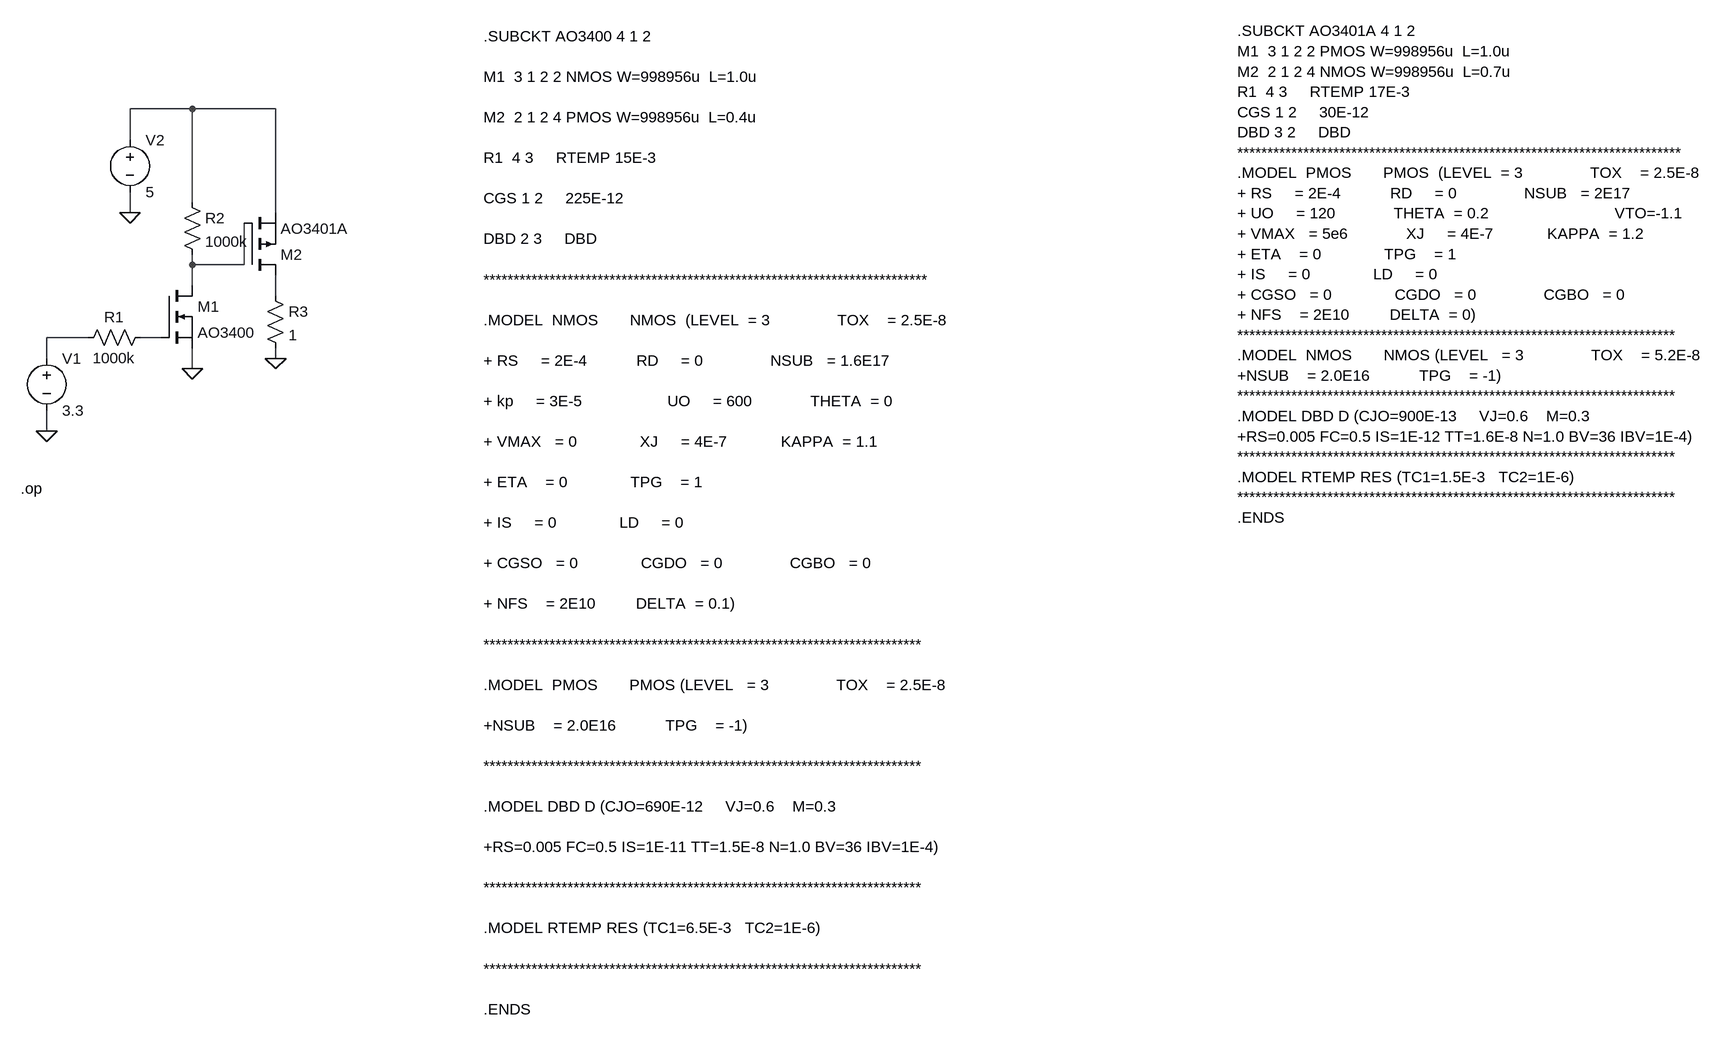
[diagram p0: schematic LoadSwitchSimulation.asc]
LoadSwitchSimulation.asc, the LTspice schematic file:
Version 4.1
SHEET 1 3032 680
WIRE 336 -224 240 -224
WIRE 464 -224 336 -224
WIRE 240 -176 240 -224
WIRE 336 -80 336 -224
WIRE 240 -64 240 -96
WIRE 464 -64 464 -224
WIRE 336 16 336 0
WIRE 416 16 416 -48
WIRE 416 16 336 16
WIRE 336 48 336 16
WIRE 464 64 464 32
WIRE 176 128 112 128
WIRE 288 128 256 128
WIRE 112 160 112 128
WIRE 464 160 464 144
WIRE 336 176 336 144
WIRE 112 272 112 240
FLAG 112 272 0
FLAG 336 176 0
FLAG 240 -64 0
FLAG 464 160 0
SYMBOL voltage 112 144 R0
WINDOW 123 0 0 Left 0
WINDOW 39 0 0 Left 0
SYMATTR InstName V1
SYMATTR Value 3.3
SYMBOL res 272 112 R90
WINDOW 0 0 56 VBottom 2
WINDOW 3 32 56 VTop 2
SYMATTR InstName R1
SYMATTR Value 1000k
SYMBOL nmos 288 48 R0
SYMATTR InstName M1
SYMATTR Value AO3400
SYMATTR Prefix X
SYMBOL pmos 416 32 M180
SYMATTR InstName M2
SYMATTR Value AO3401A
SYMATTR Prefix X
SYMBOL res 320 -96 R0
SYMATTR InstName R2
SYMATTR Value 1000k
SYMBOL voltage 240 -192 R0
WINDOW 123 0 0 Left 0
WINDOW 39 0 0 Left 0
SYMATTR InstName V2
SYMATTR Value 5
SYMBOL res 448 48 R0
SYMATTR InstName R3
SYMATTR Value 1
TEXT 784 -336 Left 2 !.SUBCKT AO3400 4 1 2\n\nM1  3 1 2 2 NMOS W=998956u  L=1.0u \n\nM2  2 1 2 4 PMOS W=998956u  L=0.4u\n\nR1  4 3     RTEMP 15E-3\n\nCGS 1 2     225E-12\n\nDBD 2 3     DBD\n\n**************************************************************************\n\n.MODEL  NMOS       NMOS  (LEVEL  = 3               TOX    = 2.5E-8\n\n+ RS     = 2E-4           RD     = 0               NSUB   = 1.6E17  \n\n+ kp     = 3E-5                   UO     = 600             THETA  = 0\n\n+ VMAX   = 0              XJ     = 4E-7            KAPPA  = 1.1\n\n+ ETA    = 0              TPG    = 1  \n\n+ IS     = 0              LD     = 0                           \n\n+ CGSO   = 0              CGDO   = 0               CGBO   = 0 \n\n+ NFS    = 2E10         DELTA  = 0.1)\n\n*************************************************************************\n\n.MODEL  PMOS       PMOS (LEVEL   = 3               TOX    = 2.5E-8\n\n+NSUB    = 2.0E16           TPG    = -1)   \n\n*************************************************************************\n\n.MODEL DBD D (CJO=690E-12     VJ=0.6    M=0.3\n\n+RS=0.005 FC=0.5 IS=1E-11 TT=1.5E-8 N=1.0 BV=36 IBV=1E-4)\n\n*************************************************************************\n\n.MODEL RTEMP RES (TC1=6.5E-3   TC2=1E-6)\n\n*************************************************************************\n\n.ENDS
TEXT 1944 -344 Left 2 !.SUBCKT AO3401A 4 1 2\nM1  3 1 2 2 PMOS W=998956u  L=1.0u \nM2  2 1 2 4 NMOS W=998956u  L=0.7u\nR1  4 3     RTEMP 17E-3\nCGS 1 2     30E-12\nDBD 3 2     DBD\n**************************************************************************\n.MODEL  PMOS       PMOS  (LEVEL  = 3               TOX    = 2.5E-8\n+ RS     = 2E-4           RD     = 0               NSUB   = 2E17  \n+ UO     = 120             THETA  = 0.2                            VTO=-1.1\n+ VMAX   = 5e6             XJ     = 4E-7            KAPPA  = 1.2\n+ ETA    = 0              TPG    = 1  \n+ IS     = 0              LD     = 0                           \n+ CGSO   = 0              CGDO   = 0               CGBO   = 0 \n+ NFS    = 2E10         DELTA  = 0)\n*************************************************************************\n.MODEL  NMOS       NMOS (LEVEL   = 3               TOX    = 5.2E-8\n+NSUB    = 2.0E16           TPG    = -1)   \n*************************************************************************\n.MODEL DBD D (CJO=900E-13     VJ=0.6    M=0.3\n+RS=0.005 FC=0.5 IS=1E-12 TT=1.6E-8 N=1.0 BV=36 IBV=1E-4)\n*************************************************************************\n.MODEL RTEMP RES (TC1=1.5E-3   TC2=1E-6)\n*************************************************************************\n.ENDS
TEXT 72 360 Left 2 !.op

The netlist it stands for:
* LoadSwitchSimulation.asc
V1 N004 0 3.3
R1 N005 N004 1000k
X§M1 N002 N005 0 AO3400  ; pins D G S
X§M2 N003 N002 N001 AO3401A  ; pins D G S
R2 N001 N002 1000k
V2 N001 0 5
R3 N003 0 1
.SUBCKT AO3400 4 1 2
M1  3 1 2 2 NMOS W=998956u  L=1.0u
M2  2 1 2 4 PMOS W=998956u  L=0.4u
R1  4 3     RTEMP 15E-3
CGS 1 2     225E-12
DBD 2 3     DBD
**************************************************************************
.MODEL  NMOS       NMOS  (LEVEL  = 3               TOX    = 2.5E-8
+ RS     = 2E-4           RD     = 0               NSUB   = 1.6E17
+ kp     = 3E-5                   UO     = 600             THETA  = 0
+ VMAX   = 0              XJ     = 4E-7            KAPPA  = 1.1
+ ETA    = 0              TPG    = 1
+ IS     = 0              LD     = 0
+ CGSO   = 0              CGDO   = 0               CGBO   = 0
+ NFS    = 2E10         DELTA  = 0.1)
*************************************************************************
.MODEL  PMOS       PMOS (LEVEL   = 3               TOX    = 2.5E-8
+NSUB    = 2.0E16           TPG    = -1)
*************************************************************************
.MODEL DBD D (CJO=690E-12     VJ=0.6    M=0.3
+RS=0.005 FC=0.5 IS=1E-11 TT=1.5E-8 N=1.0 BV=36 IBV=1E-4)
*************************************************************************
.MODEL RTEMP RES (TC1=6.5E-3   TC2=1E-6)
*************************************************************************
.ENDS
.SUBCKT AO3401A 4 1 2
M1  3 1 2 2 PMOS W=998956u  L=1.0u
M2  2 1 2 4 NMOS W=998956u  L=0.7u
R1  4 3     RTEMP 17E-3
CGS 1 2     30E-12
DBD 3 2     DBD
**************************************************************************
.MODEL  PMOS       PMOS  (LEVEL  = 3               TOX    = 2.5E-8
+ RS     = 2E-4           RD     = 0               NSUB   = 2E17
+ UO     = 120             THETA  = 0.2                            VTO=-1.1
+ VMAX   = 5e6             XJ     = 4E-7            KAPPA  = 1.2
+ ETA    = 0              TPG    = 1
+ IS     = 0              LD     = 0
+ CGSO   = 0              CGDO   = 0               CGBO   = 0
+ NFS    = 2E10         DELTA  = 0)
*************************************************************************
.MODEL  NMOS       NMOS (LEVEL   = 3               TOX    = 5.2E-8
+NSUB    = 2.0E16           TPG    = -1)
*************************************************************************
.MODEL DBD D (CJO=900E-13     VJ=0.6    M=0.3
+RS=0.005 FC=0.5 IS=1E-12 TT=1.6E-8 N=1.0 BV=36 IBV=1E-4)
*************************************************************************
.MODEL RTEMP RES (TC1=1.5E-3   TC2=1E-6)
*************************************************************************
.ENDS
.op
.backanno
.end